# Altium schematic sheet Steppers.SchDoc
size A4
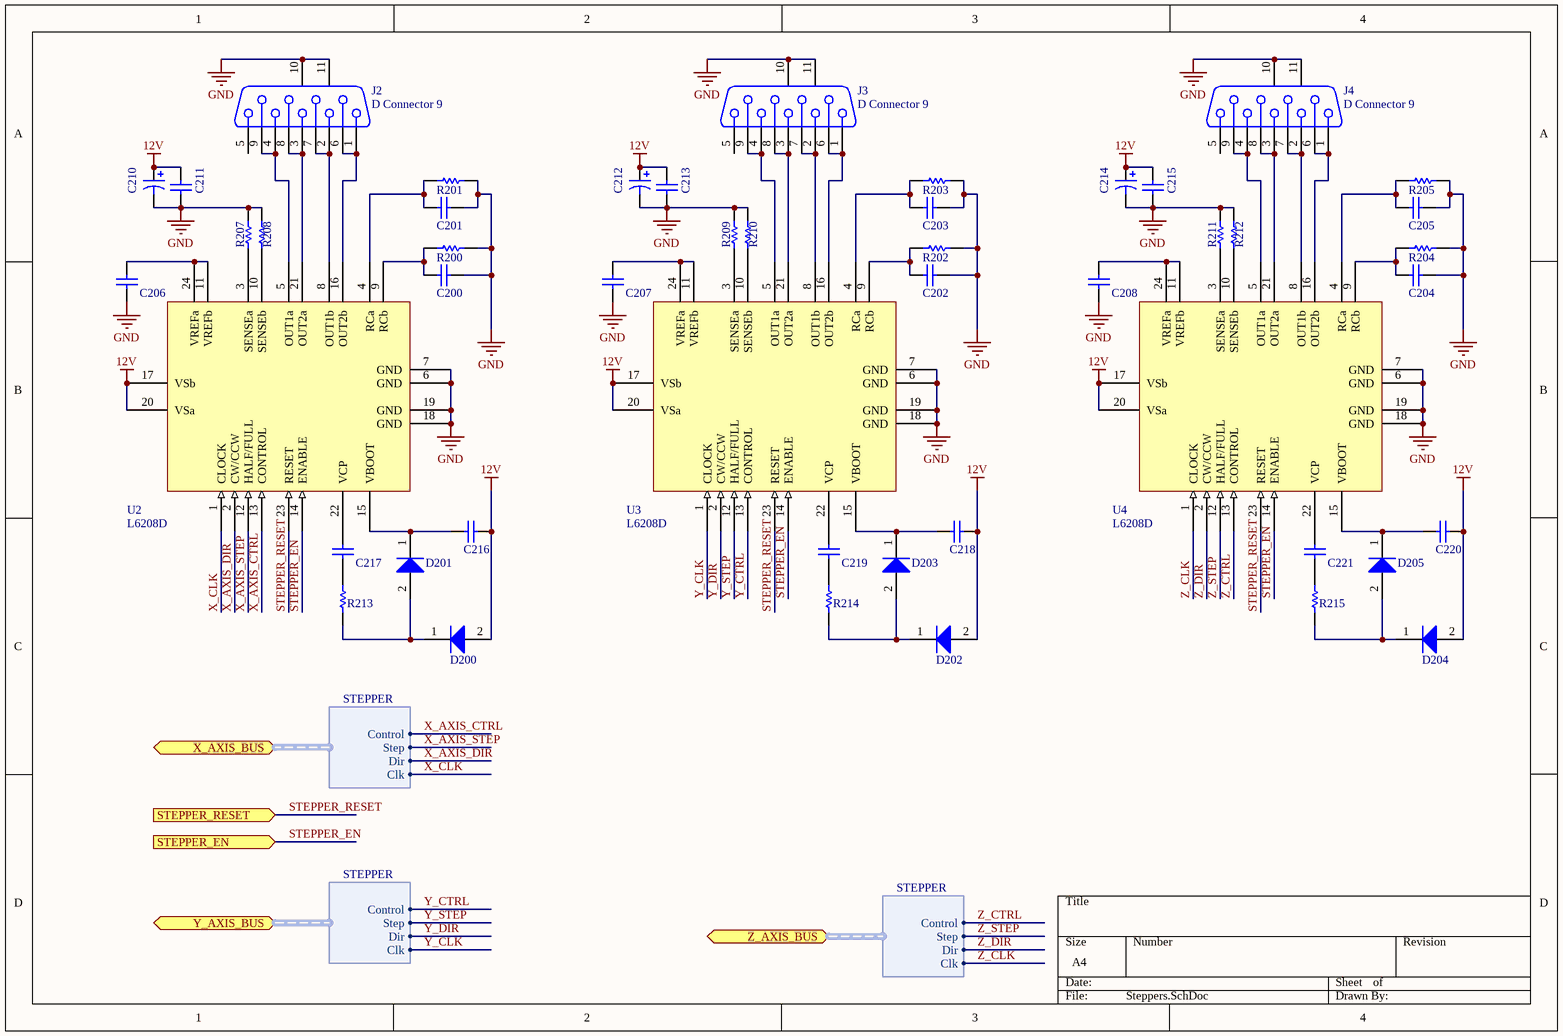
[diagram p0: Steppers.SchDoc]

## Parts
C200  CAP 100nF 10V 1206(3216)  [CAPC1206(3216)190_N]  (value not drawn)
C201  CAP 100nF 10V 1206(3216)  [CAPC1206(3216)190_N]  (value not drawn)
C202  CAP 100nF 10V 1206(3216)  [CAPC1206(3216)190_N]  (value not drawn)
C203  CAP 100nF 10V 1206(3216)  [CAPC1206(3216)190_N]  (value not drawn)
C204  CAP 100nF 10V 1206(3216)  [CAPC1206(3216)190_N]  (value not drawn)
C205  CAP 100nF 10V 1206(3216)  [CAPC1206(3216)190_N]  (value not drawn)
C206  CAP 100nF 10V 1206(3216)  [CAPC1206(3216)190_N]  (value not drawn)
C207  CAP 100nF 10V 1206(3216)  [CAPC1206(3216)190_N]  (value not drawn)
C208  CAP 100nF 10V 1206(3216)  [CAPC1206(3216)190_N]  (value not drawn)
C210  T491B  [B]  (value not drawn)
C211  CAP 100nF 10V 1206(3216)  [CAPC1206(3216)190_N]  (value not drawn)
C212  T491B  [B]  (value not drawn)
C213  CAP 100nF 10V 1206(3216)  [CAPC1206(3216)190_N]  (value not drawn)
C214  T491B  [B]  (value not drawn)
C215  CAP 100nF 10V 1206(3216)  [CAPC1206(3216)190_N]  (value not drawn)
C216  CAP 100nF 10V 1206(3216)  [CAPC1206(3216)190_N]  (value not drawn)
C217  CAP 100nF 10V 1206(3216)  [CAPC1206(3216)190_N]  (value not drawn)
C218  CAP 100nF 10V 1206(3216)  [CAPC1206(3216)190_N]  (value not drawn)
C219  CAP 100nF 10V 1206(3216)  [CAPC1206(3216)190_N]  (value not drawn)
C220  CAP 100nF 10V 1206(3216)  [CAPC1206(3216)190_N]  (value not drawn)
C221  CAP 100nF 10V 1206(3216)  [CAPC1206(3216)190_N]  (value not drawn)
D200  NSR0340HT1G  [ONSC-SOD-323-2-477-02_V]  (value not drawn)
D201  NSR0340HT1G  [ONSC-SOD-323-2-477-02_V]  (value not drawn)
D202  NSR0340HT1G  [ONSC-SOD-323-2-477-02_V]  (value not drawn)
D203  NSR0340HT1G  [ONSC-SOD-323-2-477-02_V]  (value not drawn)
D204  NSR0340HT1G  [ONSC-SOD-323-2-477-02_V]  (value not drawn)
D205  NSR0340HT1G  [ONSC-SOD-323-2-477-02_V]  (value not drawn)
J2  D Connector 9  [DSUB1.385-2H9]
J3  D Connector 9  [DSUB1.385-2H9]
J4  D Connector 9  [DSUB1.385-2H9]
R200  1K 5% 1206(3216)  [RESC1206(3216)_N]  (value not drawn)
R201  1K 5% 1206(3216)  [RESC1206(3216)_N]  (value not drawn)
R202  1K 5% 1206(3216)  [RESC1206(3216)_N]  (value not drawn)
R203  1K 5% 1206(3216)  [RESC1206(3216)_N]  (value not drawn)
R204  1K 5% 1206(3216)  [RESC1206(3216)_N]  (value not drawn)
R205  1K 5% 1206(3216)  [RESC1206(3216)_N]  (value not drawn)
R207  1R 5% 1210(3225)  [RESC1210(3225)_N]  (value not drawn)
R208  1R 5% 1210(3225)  [RESC1210(3225)_N]  (value not drawn)
R209  1R 5% 1210(3225)  [RESC1210(3225)_N]  (value not drawn)
R210  1R 5% 1210(3225)  [RESC1210(3225)_N]  (value not drawn)
R211  1R 5% 1210(3225)  [RESC1210(3225)_N]  (value not drawn)
R212  1R 5% 1210(3225)  [RESC1210(3225)_N]  (value not drawn)
R213  1K 5% 1206(3216)  [RESC1206(3216)_N]  (value not drawn)
R214  1K 5% 1206(3216)  [RESC1206(3216)_N]  (value not drawn)
R215  1K 5% 1206(3216)  [RESC1206(3216)_N]  (value not drawn)
U2  L6208D  [SO24_L]
U3  L6208D  [SO24_L]
U4  L6208D  [SO24_L]

## Ports
STEPPER_EN (in), STEPPER_RESET (in), X_AXIS_BUS (harness STEPPER), Y_AXIS_BUS (harness STEPPER), Z_AXIS_BUS (harness STEPPER)

## Harnesses
STEPPER: Clk, Dir, Step, Control

## Nets
12V: C210.1 C211.2 C212.1 C213.2 C214.1 C215.2 C216.1 C218.1 C220.1 D200.2(A) D202.2(A) D204.2(A) U2.17(VSb) U2.20(VSa) U3.17(VSb) U3.20(VSa) U4.17(VSb) U4.20(VSa)
GND: C200.2 C201.2 C202.2 C203.2 C204.2 C205.2 C206.1 C207.1 C208.1 C210.2 C211.1 C212.2 C213.1 C214.2 C215.1 J2.10(MH1) J2.11(MH2) J3.10(MH1) J3.11(MH2) J4.10(MH1) J4.11(MH2) R200.2 R201.2 R202.2 R203.2 R204.2 R205.2 R207.2 R208.2 R209.2 R210.2 R211.2 R212.2 U2.6(GND) U2.7(GND) U2.18(GND) U2.19(GND) U3.6(GND) U3.7(GND) U3.18(GND) U3.19(GND) U4.6(GND) U4.7(GND) U4.18(GND) U4.19(GND)
STEPPER_EN: U2.14(ENABLE) U3.14(ENABLE) U4.14(ENABLE) ; port STEPPER_EN
STEPPER_RESET: U2.23(RESET) U3.23(RESET) U4.23(RESET) ; port STEPPER_RESET
X_AXIS_CTRL: U2.13(CONTROL) ; port X_AXIS_BUS.Control
X_AXIS_DIR: U2.2(CW/CCW) ; port X_AXIS_BUS.Dir
X_AXIS_STEP: U2.12(HALF/FULL) ; port X_AXIS_BUS.Step
X_CLK: U2.1(CLOCK) ; port X_AXIS_BUS.Clk
Y_CLK: U3.1(CLOCK) ; port Y_AXIS_BUS.Clk
Y_CTRL: U3.13(CONTROL) ; port Y_AXIS_BUS.Control
Y_DIR: U3.2(CW/CCW) ; port Y_AXIS_BUS.Dir
Y_STEP: U3.12(HALF/FULL) ; port Y_AXIS_BUS.Step
Z_CLK: U4.1(CLOCK) ; port Z_AXIS_BUS.Clk
Z_CTRL: U4.13(CONTROL) ; port Z_AXIS_BUS.Control
Z_DIR: U4.2(CW/CCW) ; port Z_AXIS_BUS.Dir
Z_STEP: U4.12(HALF/FULL) ; port Z_AXIS_BUS.Step
NetC200_1: C200.1 R200.1 U2.9(RCb)
NetC201_1: C201.1 R201.1 U2.4(RCa)
NetC202_1: C202.1 R202.1 U3.9(RCb)
NetC203_1: C203.1 R203.1 U3.4(RCa)
NetC204_1: C204.1 R204.1 U4.9(RCb)
NetC205_1: C205.1 R205.1 U4.4(RCa)
NetC206_2: C206.2 U2.11(VREFb) U2.24(VREFa)
NetC207_2: C207.2 U3.11(VREFb) U3.24(VREFa)
NetC208_2: C208.2 U4.11(VREFb) U4.24(VREFa)
NetC216_2: C216.2 D201.1(K) U2.15(VBOOT)
NetC217_1: C217.1 R213.2
NetC217_2: C217.2 U2.22(VCP)
NetC218_2: C218.2 D203.1(K) U3.15(VBOOT)
NetC219_1: C219.1 R214.2
NetC219_2: C219.2 U3.22(VCP)
NetC220_2: C220.2 D205.1(K) U4.15(VBOOT)
NetC221_1: C221.1 R215.2
NetC221_2: C221.2 U4.22(VCP)
NetD200_1: D200.1(K) D201.2(A) R213.1
NetD202_1: D202.1(K) D203.2(A) R214.1
NetD204_1: D204.1(K) D205.2(A) R215.1
NetJ2_1: J2.1 J2.6 U2.16(OUT2b)
NetJ2_2: J2.2 J2.7 U2.8(OUT1b)
NetJ2_3: J2.3 J2.8 U2.21(OUT2a)
NetJ2_4: J2.4 J2.9 U2.5(OUT1a)
NetJ3_1: J3.1 J3.6 U3.16(OUT2b)
NetJ3_2: J3.2 J3.7 U3.8(OUT1b)
NetJ3_3: J3.3 J3.8 U3.21(OUT2a)
NetJ3_4: J3.4 J3.9 U3.5(OUT1a)
NetJ4_1: J4.1 J4.6 U4.16(OUT2b)
NetJ4_2: J4.2 J4.7 U4.8(OUT1b)
NetJ4_3: J4.3 J4.8 U4.21(OUT2a)
NetJ4_4: J4.4 J4.9 U4.5(OUT1a)
NetR207_1: R207.1 U2.3(SENSEa)
NetR208_1: R208.1 U2.10(SENSEb)
NetR209_1: R209.1 U3.3(SENSEa)
NetR210_1: R210.1 U3.10(SENSEb)
NetR211_1: R211.1 U4.3(SENSEa)
NetR212_1: R212.1 U4.10(SENSEb)

Not connected (* = marked no-connect by the designer): J2 5; J3 5; J4 5

## Library data of the parts
C200-C208 C211 C213 C215-C221 = CMP-1037-04171-1: CAP 100nF 10V ±5% 1206 (3216 Metric) Thickness 1.9mm SMD; Tolerance: Â±5%; Case-Metric: 3216; Case-EIA: 1206; Value: 100nF; Rated Voltage: 10 V; Technology: SMT; Max Thickness: 1.9 mm
C210 C212 C214 = T491B: Solid Tantalum Chip Capacitor, Standard T491 Series - Industrial Grade; Value: 100pF; Published: 17-Jul-2002; LatestRevisionDate: 19-Mar-2004; LatestRevisionNote: Silkscreen dimensions re-sized.; DatasheetDocument: Mar-2001; PackageDocument: Mar-2001; PackageReference: B; Publisher: Altium Limited; Code_JEITA: 3528-21; ComponentLink1Description: Manufacturer Link; ComponentLink1URL: http://www.kemet.com/; ComponentLink2Description: Datasheet; ComponentLink2URL: http://www.kemet.com/kemet/web/homepage/kechome.nsf/vapubfilesname/F3102TA.pdf/$file/F3102TA.pdf
D200-D205 = CMP-1055-00472-1: Schottky Barrier Diode, 2-Pin SOD-323, Pb-Free, Tape and Reel; Manufacturer: On Semiconductor; IFSM Max (A): 1; Configuration: Single; PackageDescription: 2-Pin SOD, Body 1.7 x 1.25 mm; ComponentLink2Description: Datasheet; PartNumber: NSR0340HT1G; ComponentLink3URL: http://www.onsemi.com/pub_link/Collateral/477-02.PDF.1; Packing: Tape and Reel; PackageVersion: Rev. H, 03/2007; ComponentLink1URL: http://www.onsemi.com/; ComponentLink2URL: http://www.onsemi.cn/pub_link/Collateral/NSR0340H-D.PDF; ComponentLink3Description: Package Specification; ComponentLink1Description: Manufacturer URL; Mounting Technology: Surface Mount; RoHS: TRUE; PackageReference: SOD-323-2-477-02; DatasheetVersion: Rev. 1
J2-J4 = D Connector 9: Receptacle Assembly, 9 Position, Right Angle; PackageDocument: O; Positions: 9; Published: 15-Jun-2001; LatestRevisionDate: 17-Jul-2002; LatestRevisionNote: Re-released for DXP Platform.; DatasheetDocument: 1-Sep-1999; PackageReference: 788750; Publisher: Altium Limited; Orientation: Right Angle; Gender: Receptacle
R200-R205 R213-R215 = CMP-1014-00074-1: 1K 0.25W 5% 1206 (3216 Metric)  SMD; Value: 1000.00 Ohm; Case-Metric: 3216; Case-EIA: 1206; Tolerance: 5 %; Power: 0.25 W; Technology: SMT
R207-R212 = CMP-1015-00002-1: 1R 0.5W 5% 1210 (3225 Metric)  SMD; Case-EIA: 1210; Value: 1.00 Ohm; Case-Metric: 3225; Power: 0.5 W; Technology: SMT; Tolerance: 5 %
U2-U4 = L6208D: Stepper controler